# EAGLE design brenner8pminiPr5_silviu (EAGLE 4.15)
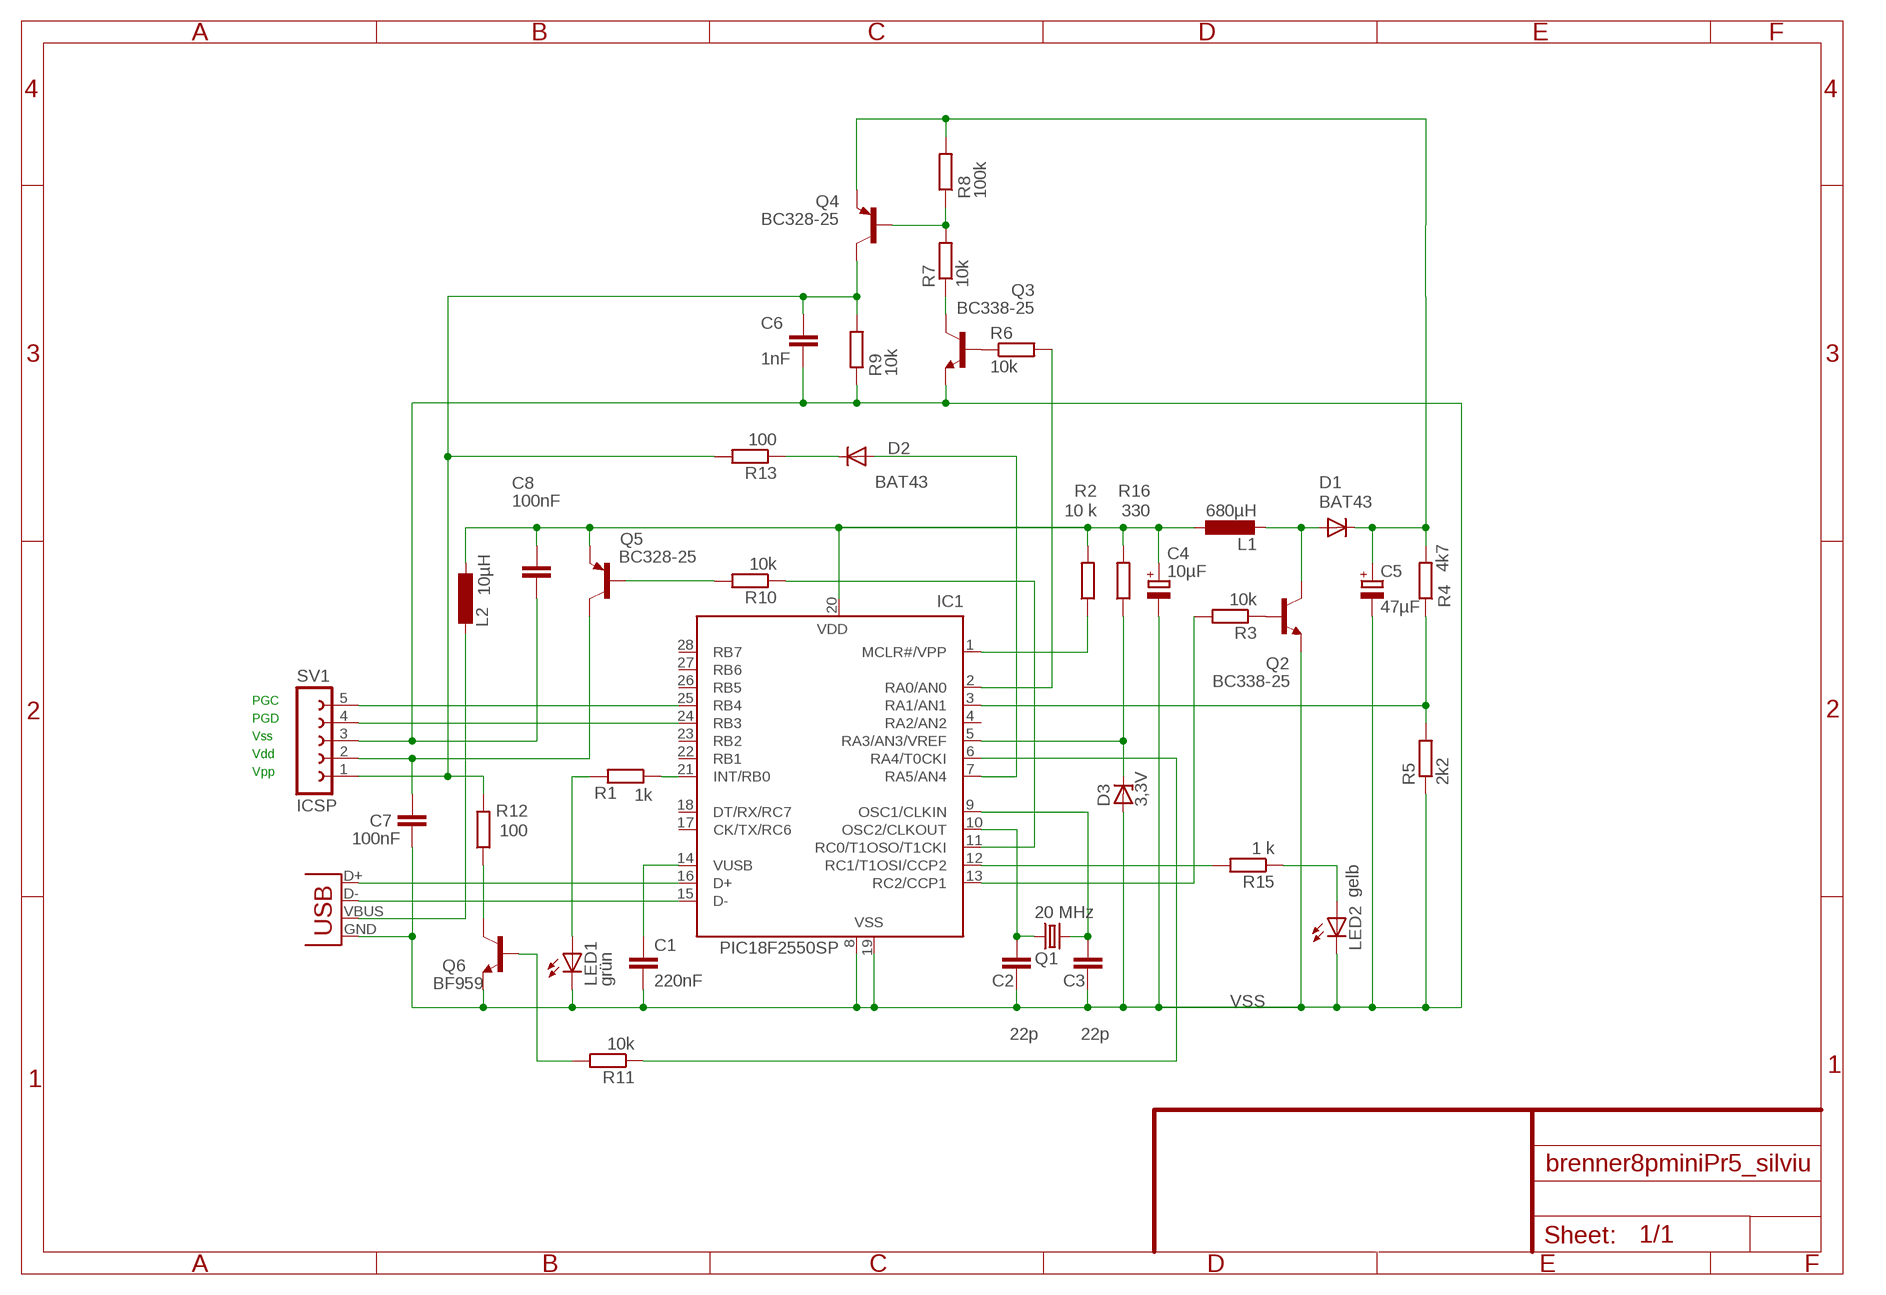
[diagram p0: schematic, sheet 1]

## Parts
C1  220nF  C-EU050-025X075  [C050-025X075]
C2  22p  C-EU025-025X050  [C025-025X050]
C3  22p  C-EU025-025X050  [C025-025X050]
C4  10µF  CPOL-EUE2,5-6E  [E2,5-6E]
C5  47µF  CPOL-EUE2,5-6E  [E2,5-6E]
C6  1nF  C-EU050-025X075  [C050-025X075]
C7  100nF  C-EU050-025X075  [C050-025X075]
C8  100nF  C-EU050-025X075  [C050-025X075]
D1  BAT43  1N4004  [DO41-10]
D2  BAT43  1N4004  [DO41-10]
D3  3,3V  BZX90  [DO34Z7]
IC1  PIC18F2550SP  PIC18F2455SP  [DIL28-3]
L1  680µH  L-EU0207/10  [0207/10]
L2  10µH  L-EU0207/10  [0207/10]
LED1  grün  LED3MM  [LED3MM]
LED2  gelb  LED3MM  [LED3MM]
Q1  20 MHz  CRYTALHC49S  [HC49/S]
Q2  BC338-25  [TO92-EBC]
Q3  BC338-25  [TO92-EBC]
Q4  BC328-25  [TO92-EBC]
Q5  BC328-25  [TO92-EBC]
Q6  BF959  BF959-NPN-TO92-BEC  [TO92-BEC]
R1  1k  R-EU_0207/10  [0207/10]
R2  10 k  R-EU_0207/10  [0207/10]
R3  10k  R-EU_0207/10  [0207/10]
R4  4k7  R-EU_0207/10  [0207/10]
R5  2k2  R-EU_0207/10  [0207/10]
R6  10k  R-EU_0207/10  [0207/10]
R7  10k  R-EU_0207/10  [0207/10]
R8  100k  R-EU_0207/10  [0207/10]
R9  10k  R-EU_0207/10  [0207/10]
R10  10k  R-EU_0207/10  [0207/10]
R11  10k  R-EU_0207/10  [0207/10]
R12  100  R-EU_0207/10  [0207/10]
R13  100  R-EU_0207/10  [0207/10]
R15  1 k  R-EU_0207/10  [0207/10]
R16  330  R-EU_0207/10  [0207/10]
SV1  ICSP  FE05-1  [FE05-1]
X2  USB-B-H  [USB-B-H]

## Nets
+12V: C5.+ D1.C Q4.E R4.2 R8.2
CLOCK_18: IC1.25(RB4) SV1.5
DATA_18: IC1.24(RB3) SV1.4
N$1: IC1.15(D-) X2.D-
N$2: IC1.16(D+) X2.D+
N$3: L2.1 X2.VBUS
N$4: LED1.A R1.2
N$5: C1.1 IC1.14(VUSB)
N$6: C2.1 IC1.10(OSC2/CLKOUT) Q1.1
N$7: C3.1 IC1.9(OSC1/CLKIN) Q1.2
N$8: IC1.1(MCLR#/VPP) R2.1
N$9: Q5.B R10.2
N$10: IC1.12(RC1/T1OSI/CCP2) R15.2
N$11: IC1.11(RC0/T1OSO/T1CKI) R10.1
N$12: LED2.A R15.1
N$13: D1.A L1.2 Q2.C
N$14: Q2.B R3.1
N$15: IC1.13(RC2/CCP1) R3.2
N$16: IC1.21(INT/RB0) R1.1
N$17: C7.1 Q5.C SV1.2
N$18: IC1.3(RA1/AN1) R4.1 R5.2
N$19: Q6.B R11.2
N$20: IC1.6(RA4/T0CKI) R11.1
N$21: Q3.B R6.1
N$22: Q6.C R12.1
N$23: Q3.C R7.1
N$24: Q4.B R7.2 R8.1
N$25: D2.A IC1.7(RA5/AN4)
N$26: D2.C R13.1
N$28: IC1.2(RA0/AN0) R6.2
UREF: D3.C IC1.5(RA3/AN3/VREF) R16.1
VDD: C4.+ C8.1 IC1.20(VDD) L1.1 L2.2 Q5.E R2.2 R16.2
VPP_8_14_18: C6.1 Q4.C R9.2 R12.2 R13.2 SV1.1
VSS: C1.2 C2.2 C3.2 C4.- C5.- C6.2 C7.2 C8.2 D3.A IC1.8(VSS) IC1.19(VSS) LED1.K(C) LED2.K(C) Q2.E Q3.E Q6.E R5.1 R9.1 SV1.3 X2.GND
Unconnected: IC1.4(RA2/AN2) IC1.17(CK/TX/RC6) IC1.18(DT/RX/RC7) IC1.22(RB1) IC1.23(RB2) IC1.26(RB5) IC1.27(RB6) IC1.28(RB7)

## Notes on the sheet
- PGC
- PGD
- Vss
- Vdd
- Vpp

## Library data of the parts
C1-C3 C6-C8 = rcl:C-EU: CAPACITOR, European symbol
C4 C5 = rcl:CPOL-EU: POLARIZED CAPACITOR, European symbol
D1 D2 = diode:1N4004: DIODE general purpose rectifier, 1 A
D3 = diode:BZX90: Z DIODE
IC1 = sprut:PIC18F2455: FLASH based microcontroler USB 2.0 24K /ROM- 2048 Bytes RAM
L1 L2 = rcl:L-EU: INDUCTOR, European symbol
LED1 LED2 = led:LED: LED OSRAM: - CHIPLED LG R971, LG N971, LY N971, LG Q971, LY Q971, LO R971, LY R971 LH N974, LH R974 LS Q976, LO Q976, LY Q976 LO Q996 - Hyper CHIPLED LW Q18S LB Q993, LB Q99A, LB R99A - SideLED LS A670, LO A670, LY A670, LG A670, LP A670 LB A673, LV A673, LT A673, LW A673 LH A674 LY A675 LS A676, LA A676, LO A676, LY A676, LW A676 LS A679, LY A679, LG A679 - Hyper Micro SIDELED® LS Y876, LA Y876, LO Y876, LY Y876 LT Y87S - SmartLED LW L88C, LW L88S LB L89C, LB L89S, LG L890 LS L89K, LO L89K, LY L89K LS L896, LA L896, LO L896, LY L896 - TOPLED LS T670, LO T670, LY T670, LG T670, LP T670 LSG T670, LSP T670, LSY T670, LOP T670, LYG T670 LG T671, LOG T671, LSG T671 LB T673, LV T673, LT T673, LW T673 LH T674 LS T676, LA T676, LO T676, LY T676, LB T676, LH T676, LSB T676, LW T676 LB T67C, LV T67C, LT T67C, LS T67K, LO T67K, LY T67K, LW E67C LS E67B, LA E67B, LO E67B, LY E67B, LB E67C, LV E67C, LT E67C LW T67C LS T679, LY T679, LG T679 LS T770, LO T770, LY T770, LG T770, LP T770 LB T773, LV T773, LT T773, LW T773 LH T774 LS E675, LA E675, LY E675, LS T675 LS T776, LA T776, LO T776, LY T776, LB T776 LHGB T686 LT T68C, LB T68C - Hyper Mini TOPLED® LB M676 - Mini TOPLED Santana® LG M470 LS M47K, LO M47K, LY M47K Source: http://www.osram.convergy.de/
Q1 = crystal:CRYTAL: CRYSTAL
Q2 Q3 = transistor-npn:BC338*: NPN Transistor
Q4 Q5 = transistor-pnp:BC328*: PNP Transistror
Q6 = sprut:BF959-NPN-TO92-BEC
R1-R13 R15 R16 = rcl:R-EU_: RESISTOR, European symbol
SV1 = con-lsta:FE05-1: FEMALE HEADER
X2 = con-usb:USB: USB Connectors

## Board
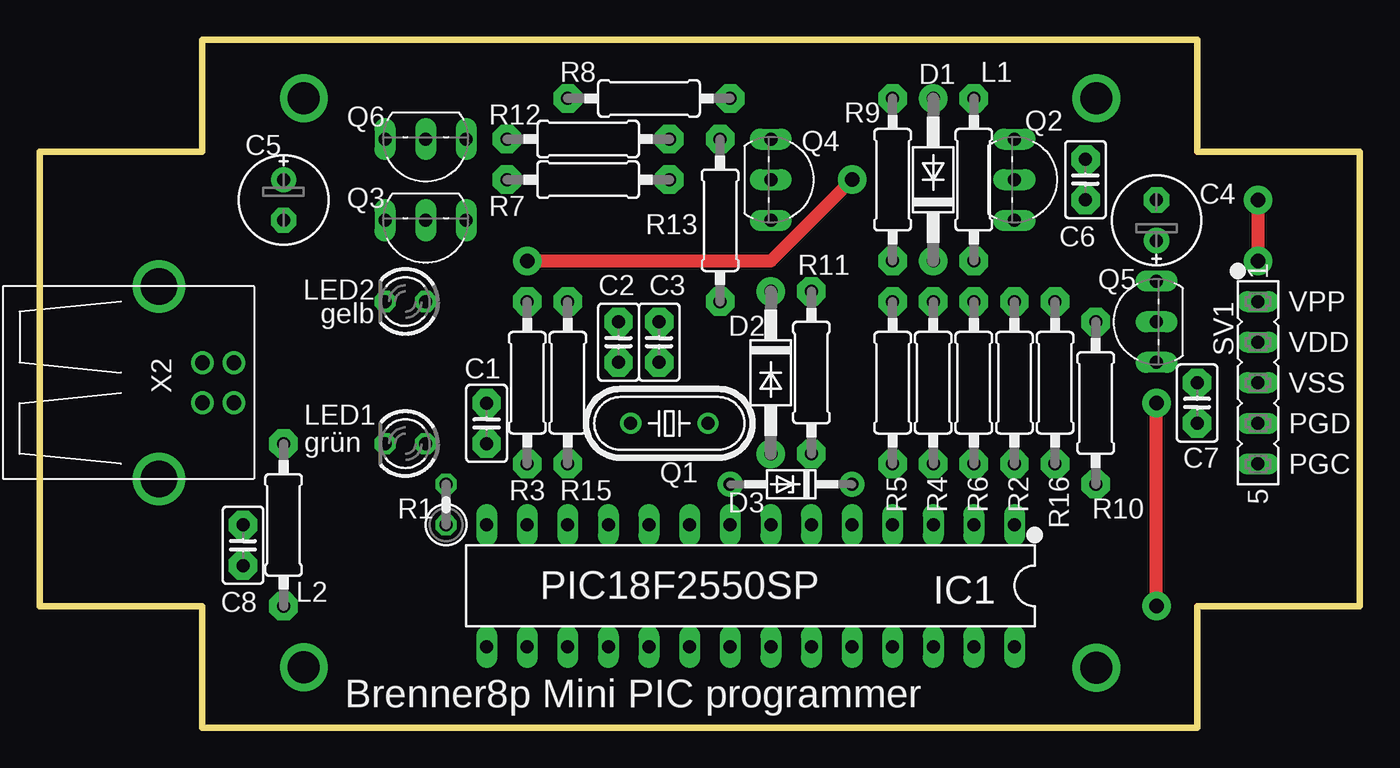
[diagram p1: board, top side]
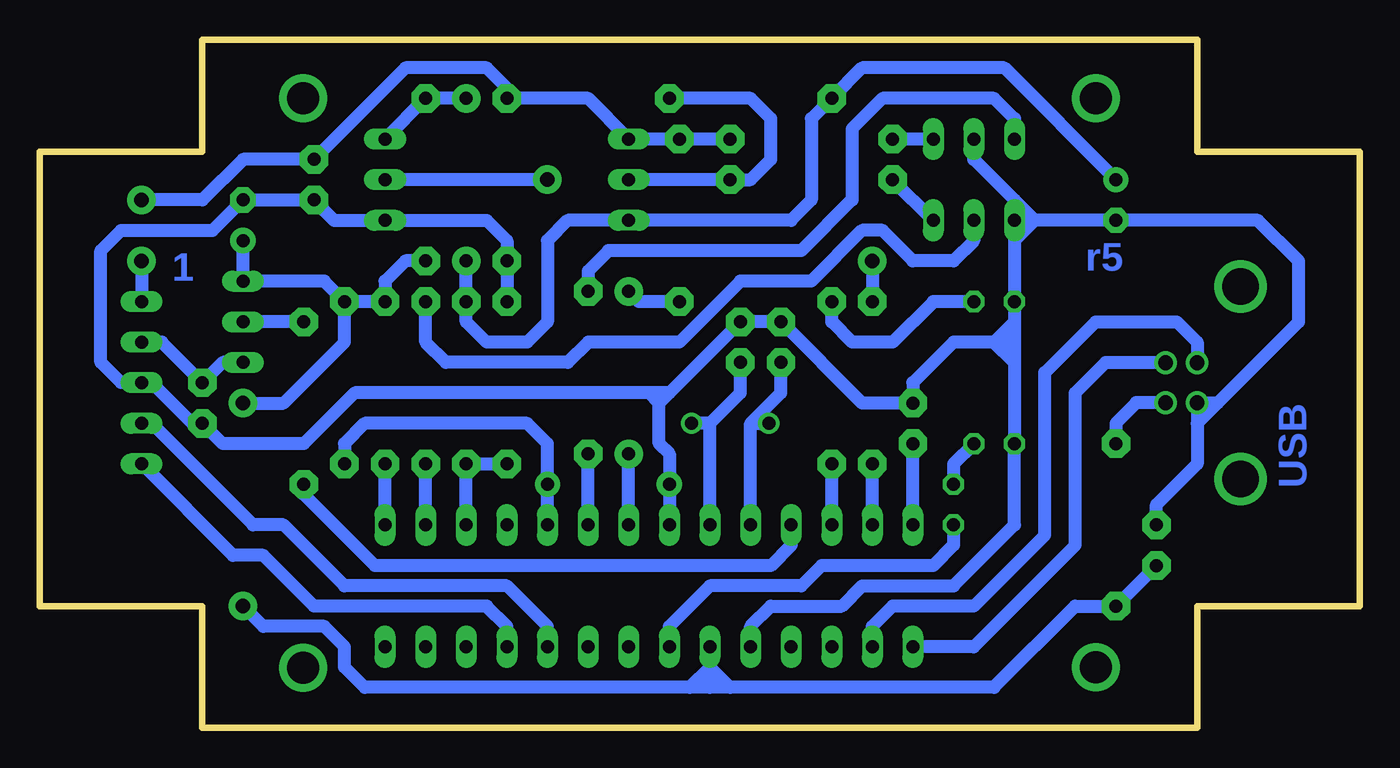
[diagram p2: board, bottom side, seen from below]

Size 82.55 x 43.03 mm. Coordinates in mm from the lower left corner, seen from the top.
Outline: 0,7.62 0,36.04 10.16,36.04 10.16,43.03 72.39,43.03 72.39,36.04 82.55,36.04 82.55,7.62 72.39,7.62 72.39,0 10.16,0 10.16,7.62 0,7.62
Copper layers (1*16): Top 0.035mm / dielectric 1.5mm / Bottom 0.035mm
Design rules: minimum track width 10mil, minimum drill 24mil, track to track 10mil, track to pad 10mil, pad to pad 10mil, via to via 10mil, smd to smd 8mil, copper to edge 40mil, drill to drill 8mil, minimum pad ring 10mil, minimum via ring 8mil, stop-mask expansion 4mil, vias tented up to drill 0mil, thermal gap 10mil

### Footprints (pad centres in the part's own frame; a part is rotated, then mirrored left to right if it is on the bottom)
C025-025X050 = drill 0.813 pad 1.778 octagon: 1 -1.27,0; 2 1.27,0
E2,5-6E = drill 0.813 pad 1.575: + -1.27,0 | drill 0.813 pad 1.575 octagon: - 1.27,0
DO41-10 = drill 0.813 pad 1.778: A 5.08,0; C -5.08,0
DO34Z7 = drill 0.813 pad 1.575: A 3.81,0; C -3.81,0
DIL28-3 = drill 0.813 long: 1 -16.51,-3.81; 2 -13.97,-3.81; 3 -11.43,-3.81; 4 -8.89,-3.81; 5 -6.35,-3.81; 6 -3.81,-3.81; 7 -1.27,-3.81; 8 1.27,-3.81; 9 3.81,-3.81; 10 6.35,-3.81; 11 8.89,-3.81; 12 11.43,-3.81; 13 13.97,-3.81; 14 16.51,-3.81; 15 16.51,3.81; 16 13.97,3.81; 17 11.43,3.81; 18 8.89,3.81; 19 6.35,3.81; 20 3.81,3.81; 21 1.27,3.81; 22 -1.27,3.81; 23 -3.81,3.81; 24 -6.35,3.81; 25 -8.89,3.81; 26 -11.43,3.81; 27 -13.97,3.81; 28 -16.51,3.81
0207/10 = drill 0.813 pad 1.778 octagon: 1 -5.08,0; 2 5.08,0
LED3MM = drill 0.813 octagon: A -1.27,0; K 1.27,0
HC49/S = drill 0.813: 1 -2.413,0; 2 2.413,0
TO92-EBC = drill 0.813 long: B 0,-1.27; C -2.54,-1.27; E 2.54,-1.27
TO92-BEC = drill 0.813 long: B 2.54,0; C -2.54,0; E 0,0
0207/2V = drill 0.813 octagon: 1 -1.27,0; 2 1.27,0
FE05-1 = drill 0.813 long: 1 -5.08,0; 2 -2.54,0; 3 0,0; 4 2.54,0; 5 5.08,0
USB-B-H = drill 0.914: D+ 0,1.25; D- 1.981,1.25; GND 0,-1.25; VBUS 1.981,-1.25 | drill 2.286: P$1 -2.718,-6.02; P$2 -2.718,6.02

### Placement (x,y rotation side)
C1  220nF  [C025-025X050]  27.94,19.05 90 top
C2  36.2,24.13 90 top
C3  38.73,24.13 90 top
C4  69.85,31.75 90 top
C5  15.24,33.02 270 top
C6  1nF  [C025-025X050]  65.41,34.29 270 top
C7  100nF  [C025-025X050]  72.39,20.32 270 top
C8  100nF  [C025-025X050]  12.7,11.43 90 top
D1  55.88,34.29 90 top
D2  45.72,22.22 270 top
D3  46.99,15.24 180 top
IC1  44.45,8.89 180 top
L1  58.42,34.29 90 top
L2  15.24,12.7 270 top
LED1  22.86,17.78 180 top
LED2  22.86,26.67 180 top
Q1  39.37,19.05 0 top
Q2  62.23,34.29 270 top
Q3  24.13,30.48 180 top
Q4  46.99,34.29 270 top
Q5  68.58,25.4 90 top
Q6  24.13,36.83 180 top
R1  1k  [0207/2V]  25.4,13.97 90 top
R2  60.96,21.59 90 top
R3  30.48,21.59 270 top
R4  55.88,21.59 90 top
R5  53.34,21.59 270 top
R6  58.42,21.59 270 top
R7  34.29,34.29 0 top
R8  38.1,39.37 180 top
R9  53.34,34.29 90 top
R10  66.04,20.32 90 top
R11  48.26,22.22 90 top
R12  34.29,36.83 0 top
R13  42.55,31.75 90 top
R15  33.02,21.59 270 top
R16  63.5,21.59 90 top
SV1  76.2,21.59 270 top
X2  10.16,21.59 0 top

### Tracks (layer width: path | path; a pad name or v marks a point on that pad's centre or on a via)
+12V
  Bottom 0.813: D1.C R4.2 55.88,25.4 54.61,24.13 52.07,24.13 50.8,25.4 50.8,30.48 49.53,31.75 Q4.E 35.56,31.75 34.29,33.02 34.29,38.1 R8.2 31.11,41.28 22.23,41.28 C5.+
CLOCK_18
  Bottom 0.813: IC1.25 53.34,6.35 54.61,7.62 65.41,7.62 68.58,10.79 70.48,10.79 SV1.5
DATA_18
  Bottom 0.813: SV1.4 75.56,19.05 69.22,12.7 67.31,12.7 63.5,8.89 53.34,8.89 50.8,6.35 IC1.24
N$1
  Bottom 0.813: X2.D- 12.16,22.86 15.88,22.86 17.78,20.95 17.78,11.43 24.13,5.08 IC1.15
N$2
  Bottom 0.813: X2.D+ 10.16,24.13 11.43,25.4 16.51,25.4 19.68,22.22 19.68,12.06 24.13,7.62 29.21,7.62 30.48,6.35 IC1.16
N$3
  Bottom 0.813: X2.VBUS 13.97,20.34 15.24,19.05 L2.1
N$4
  Bottom 0.813: LED1.A 25.4,16.51 R1.2
N$5
  Bottom 0.813: IC1.14 C1.1
N$6
  Bottom 0.813: C2.1 36.2,20.95 38.1,19.05 | IC1.10 38.1,19.05 | 38.1,19.05 Q1.1
N$7
  Bottom 0.813: IC1.9 40.64,19.05 | 40.64,19.05 Q1.2 | 40.64,19.05 38.73,20.95 C3.1
N$8
  Bottom 0.813: IC1.1 R2.1
N$9
  Bottom 0.813: R10.2 Q5.B
N$10
  Bottom 0.813: IC1.12 R15.2
N$11
  Bottom 0.813: R10.1 66.04,14.61 61.59,10.16 36.83,10.16 35.56,11.43 IC1.11
N$12
  Bottom 0.813: LED2.A 26.67,26.67 29.21,24.13 31.75,24.13 33.02,25.4 R15.1
N$13
  Bottom 0.813: D1.A L1.2 Q2.C
N$14  (via drill 0.9 pad 1.78)
  Top 0.813: v30.48,29.21 45.72,29.21 v50.8,34.29
  Bottom 0.813: v50.8,34.29 Q2.B | v30.48,29.21 R3.1
N$15
  Bottom 0.813: IC1.13 R3.2
N$16
  Bottom 0.813: R1.1 25.4,11.43 26.67,10.16 33.66,10.16 34.92,8.89 40.64,8.89 43.18,6.35 IC1.21
N$17
  Bottom 0.813: Q5.C 71.12,22.86 C7.1 74.93,24.13 SV1.2
N$18
  Bottom 0.813: IC1.3 R4.1 R5.2
N$19
  Bottom 0.813: R11.2 48.26,28.57 46.99,29.84 34.92,29.84 31.75,33.02 31.75,37.47 29.84,39.37 22.86,39.37 21.59,38.1 Q6.B
N$20
  Bottom 0.813: IC1.6 R11.1
N$21
  Bottom 0.813: R6.1 58.42,24.13 57.15,22.86 49.53,22.86 48.26,24.13 42.55,24.13 38.73,27.94 34.29,27.94 31.11,31.11 29.84,31.11 27.94,29.21 25.4,29.21 24.13,30.48 Q3.B
N$22
  Bottom 0.813: Q6.C R12.1
N$23
  Bottom 0.813: Q3.C R7.1
N$24
  Bottom 0.813: Q4.B R7.2 38.1,34.29 36.83,35.56 36.83,38.1 38.1,39.37 R8.1
N$25
  Bottom 0.813: IC1.7 D2.A
N$26
  Bottom 0.813: R13.1 45.09,26.67 D2.C
N$28
  Bottom 0.813: IC1.2 R6.2
N$29  (via drill 2)
  other vias: 16.51,3.81
N$30  (via drill 2)
  other vias: 16.51,39.37
N$31  (via drill 2)
  other vias: 66.09,39.37
N$32  (via drill 2)
  other vias: 66.09,3.77
UREF
  Bottom 0.813: IC1.5 D3.C 50.8,17.78 52.07,19.05 62.23,19.05 63.5,17.78 R16.1
VDD  (via drill 0.9 pad 1.78)
  Top 0.813: v69.85,7.62 v69.85,20.32
  Bottom 0.813: C4.+ Q5.E 64.77,27.94 R16.2 | v69.85,7.62 68.58,6.35 64.77,6.35 63.5,5.08 63.5,3.81 62.23,2.54 41.91,2.54 | 40.64,2.54 41.91,2.54 | v69.85,20.32 67.31,20.32 63.5,24.13 R16.2 | 40.64,2.54 40.64,3.81 | 40.64,3.81 IC1.20 | 39.37,2.54 22.86,2.54 17.78,7.62 L2.2 C8.1 | 39.37,2.54 40.64,2.54 | R16.2 R2.2 60.96,27.94 59.69,29.21 L1.1 | 39.37,2.54 40.64,3.81 | 40.64,3.81 41.91,2.54
VPP_8_14_18  (via drill 0.9 pad 1.78)
  Top 0.813: v76.2,33.02 v76.2,29.21
  Bottom 0.813: v76.2,29.21 SV1.1 | v76.2,33.02 72.39,33.02 69.85,35.56 C6.1 59.69,41.28 54.61,41.28 53.34,40.01 R9.2 48.26,39.37 Q4.C R13.2 R12.2
VSS
  Bottom 0.813: R5.1 R9.1 53.34,30.48 54.61,31.75 Q2.E 64.14,31.75 C6.2 C4.- 71.75,31.11 77.47,31.11 78.74,29.84 78.74,22.86 77.47,21.59 SV1.3 75.56,21.59 73.03,19.05 C7.2 71.12,17.78 66.04,17.78 62.87,20.95 44.45,20.95 | IC1.8 D3.A 43.18,17.14 43.81,17.78 43.81,20.32 | 20.32,31.75 C5.- 6.35,31.75 3.81,29.21 3.81,25.4 8.87,20.34 X2.GND 10.16,19.05 | 20.32,31.75 Q3.E | 43.18,20.95 43.81,20.95 | 43.81,20.95 44.45,20.95 | Q3.E 21.59,30.48 | 21.59,30.48 LED2.K 21.59,25.4 | 21.59,25.4 21.59,24.13 | 21.59,24.13 21.59,22.86 | 21.59,22.86 LED1.K 21.59,12.7 25.4,8.89 31.11,8.89 32.38,7.62 36.83,7.62 38.1,6.35 IC1.19 | 21.59,24.13 22.86,24.13 | 22.86,24.13 25.4,24.13 27.94,21.59 C1.2 31.11,20.32 C2.2 C3.2 43.18,20.95 | 21.59,33.02 24.13,35.56 Q6.E | Q3.E 21.59,33.02 | 43.81,20.32 43.81,20.95 | 21.59,22.86 22.86,24.13 | 22.86,24.13 21.59,25.4 | 21.59,33.02 20.32,31.75 | 21.59,30.48 20.32,31.75 | 43.18,20.95 43.81,20.32 | 43.81,20.32 44.45,20.95 | C8.2 12.7,13.97 10.16,16.51 10.16,19.05 | 8.89,20.32 10.16,19.05

### Text on the board
Bottom: r5 | 1 | USB
tPlace: VPP | VDD | VSS | PGD | PGC | Brenner8p Mini PIC programmer